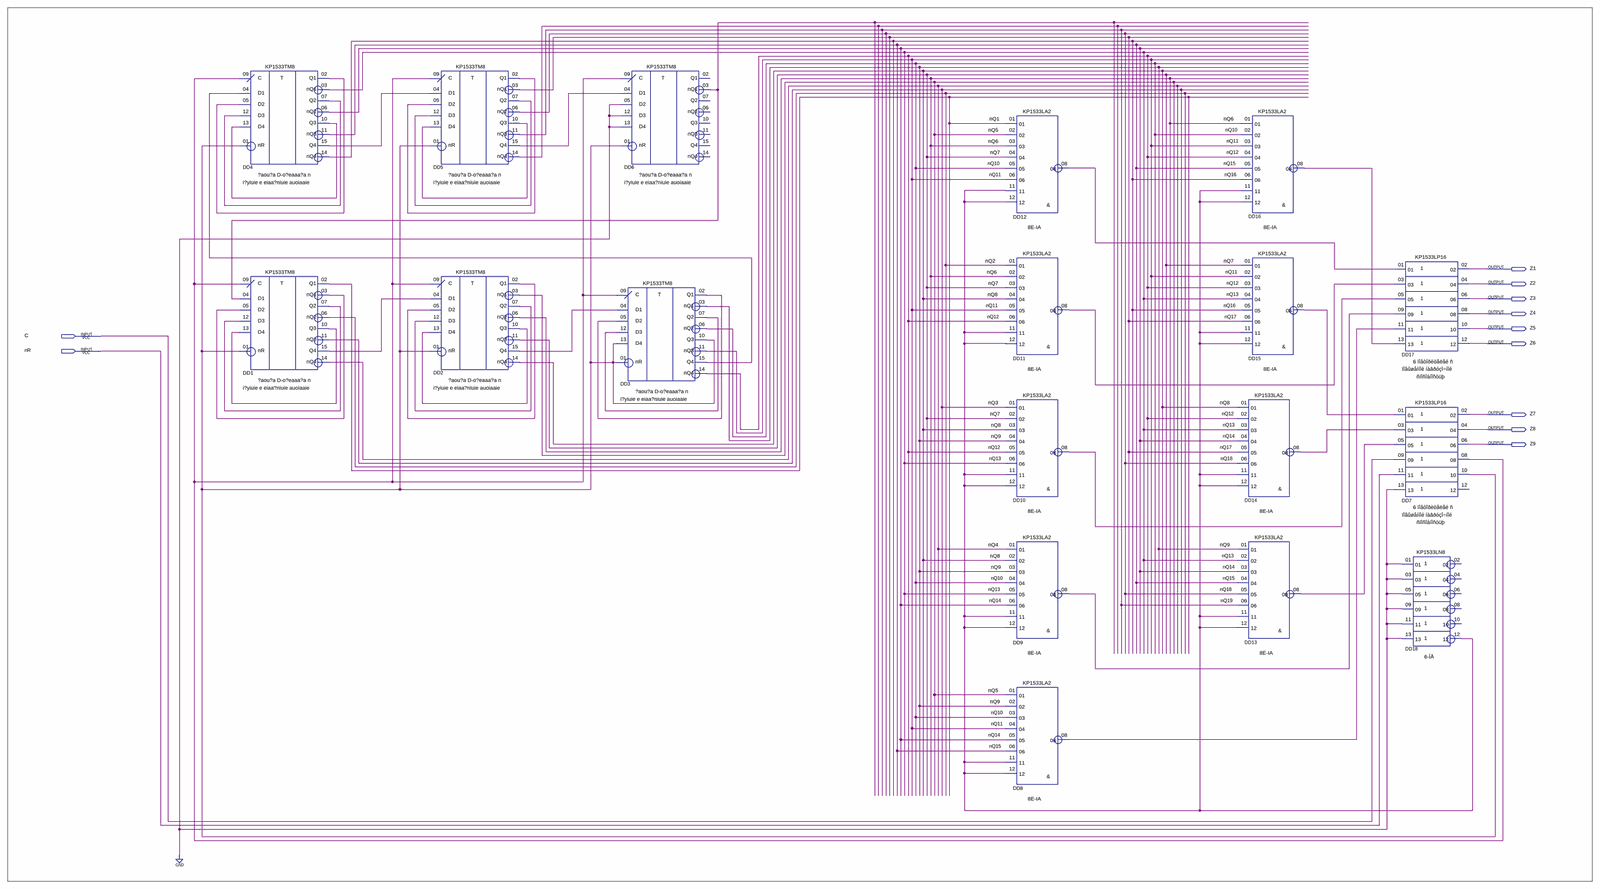
[diagram p0: schematic sheet, whole]
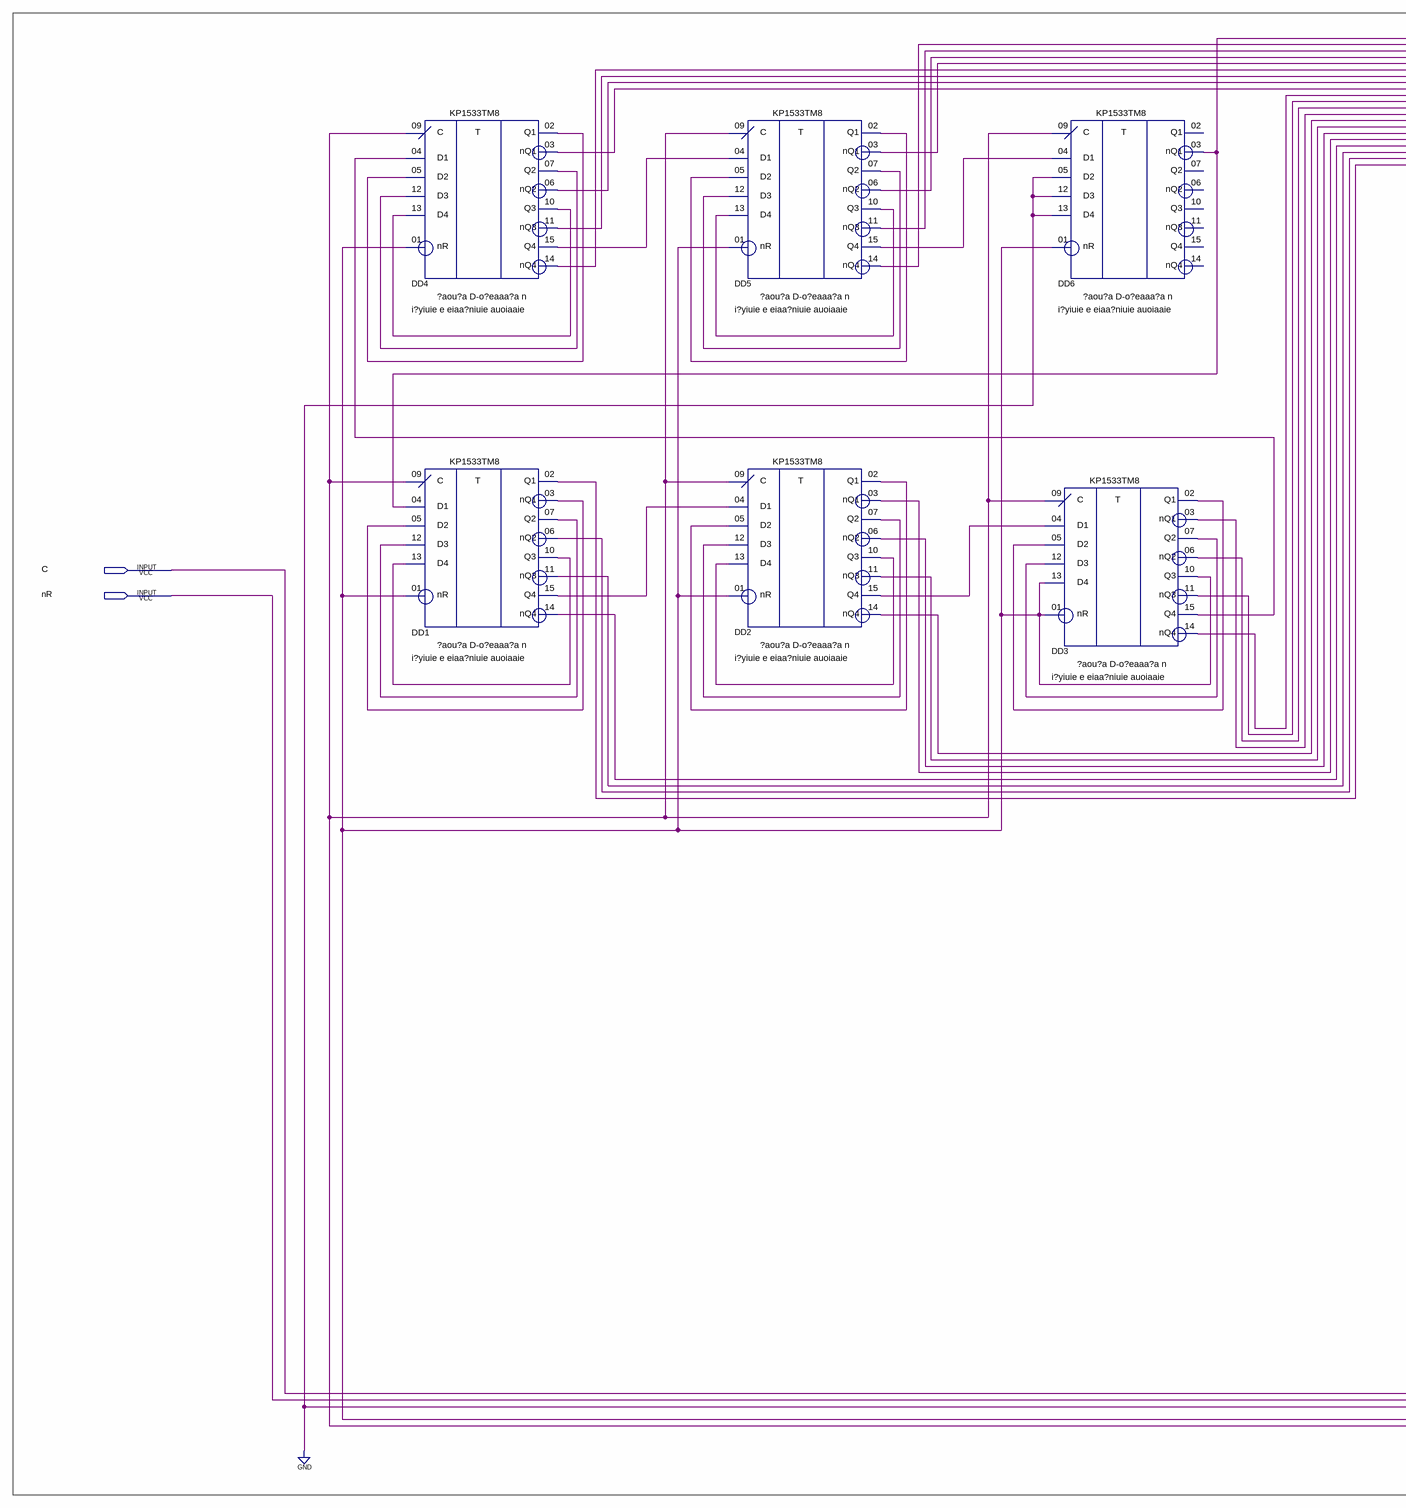
[diagram p1: schematic sheet, left part]
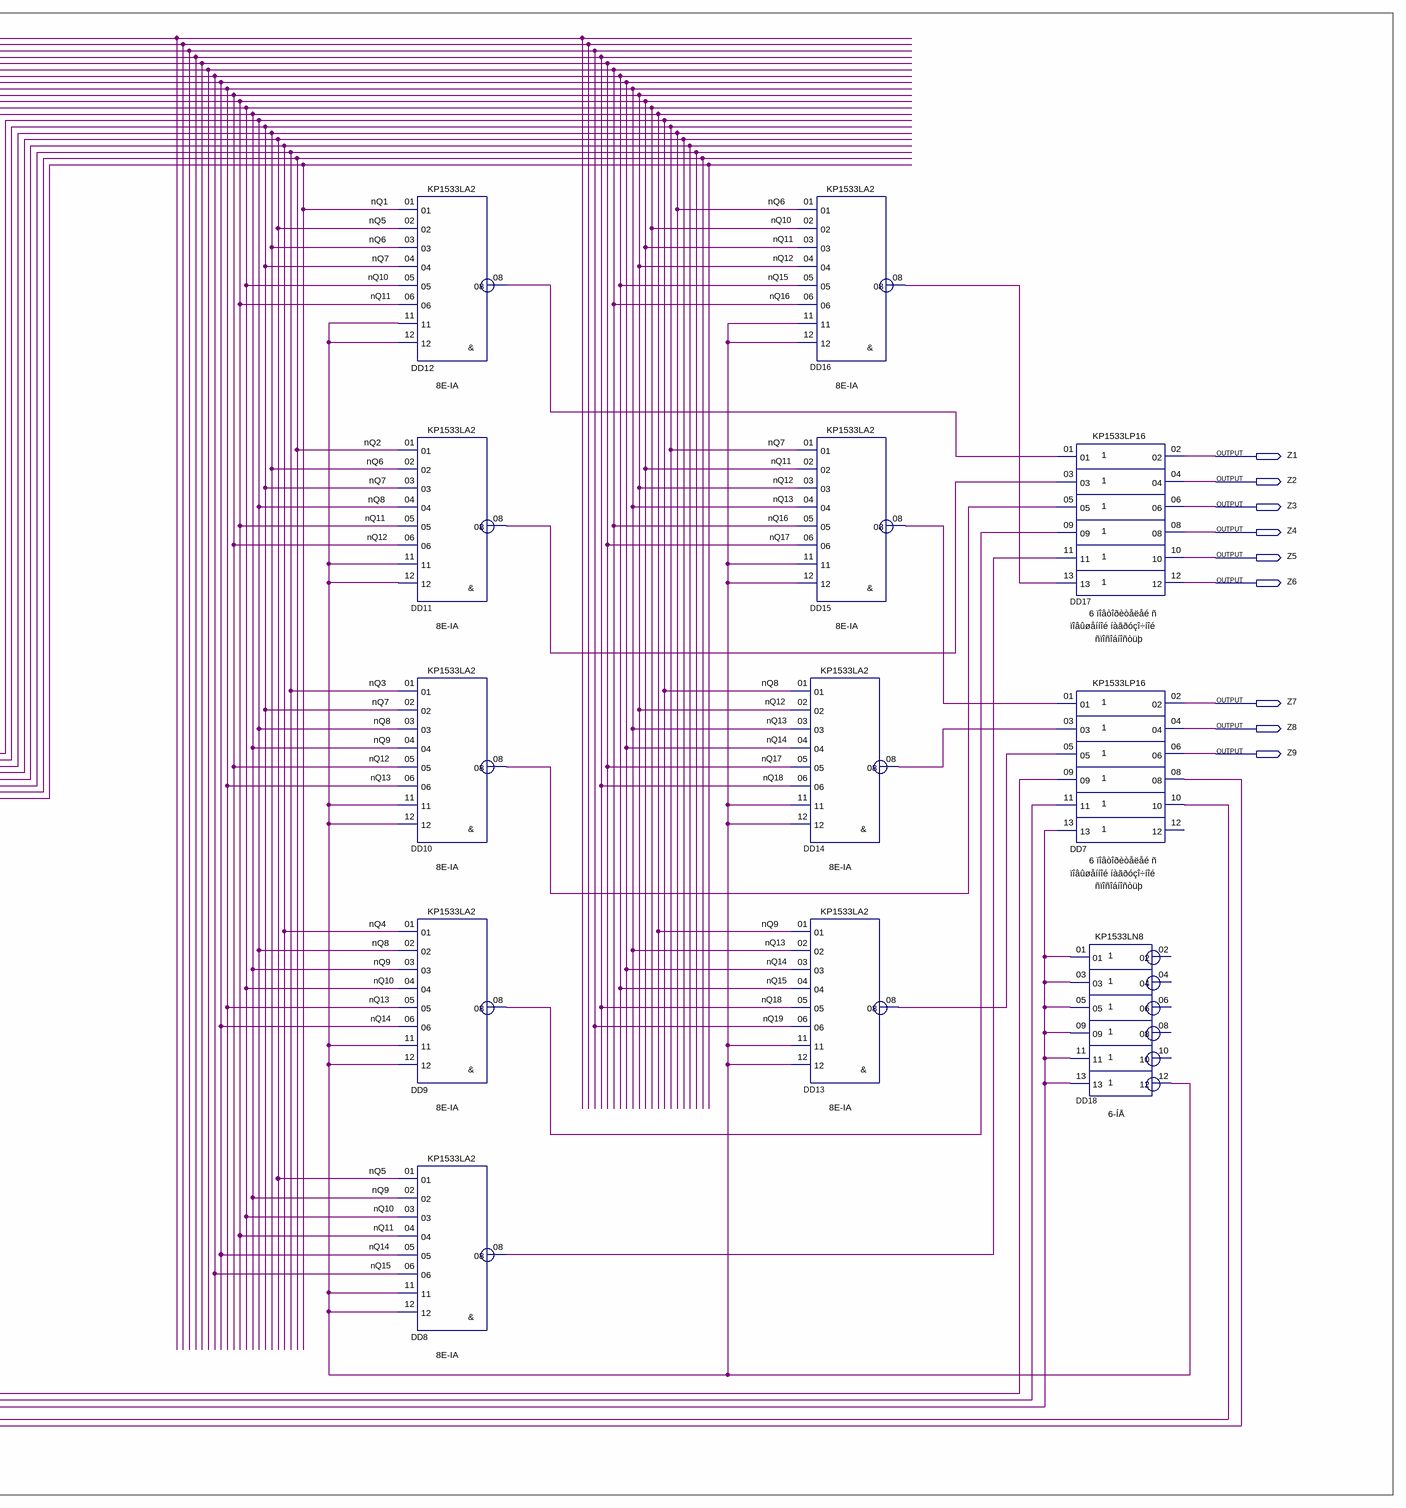
[diagram p2: schematic sheet, right part]
// Quartus schematic GN_RC_DFF_PK_NAND.bdf as structural Verilog: 18 symbols, 11 pins
module GN_RC_DFF_PK_NAND (
  input  C,
  input  nR,
  output Z1,
  output Z2,
  output Z3,
  output Z4,
  output Z5,
  output Z6,
  output Z7,
  output Z8,
  output Z9
);

  wire DD1_nq1, DD1_q2, DD1_q3, DD1_q4, DD2_q1, DD2_q2, DD2_q3, DD2_q4, DD3_q1, DD3_q2, DD3_q3, DD3_q4,
       DD4_q1, DD4_q2, DD4_q3, DD4_q4, DD5_nq4, DD5_q1, DD5_q2, DD5_q3, DD5_q4, DD6_nq1, DD7_08, DD8_08,
       DD9_08, DD10_08, DD11_08, DD12_08, DD13_08, DD14_08, DD15_08, DD16_08, DD18_12, nQ1, nQ2, nQ3, nQ4,
       nQ5, nQ6, nQ7, nQ8, nQ9, nQ10, nQ11, nQ12, nQ13, nQ14, nQ15, nQ16, nQ17, nQ18, nQ19;

  KP1533TM8 DD4 (
    .nR(DD3_q3), .C(DD7_08), .D1(DD3_q4), .D2(DD4_q1), .D3(DD4_q2), .D4(DD4_q3), .Q1(DD4_q1), .nQ1(nQ13),
    .Q2(DD4_q2), .nQ2(nQ14), .Q3(DD4_q3), .nQ3(nQ15), .Q4(DD4_q4), .nQ4(nQ16));
  KP1533TM8 DD1 (
    .nR(DD3_q3), .C(DD7_08), .D1(DD6_nq1), .D2(DD1_nq1), .D3(DD1_q2), .D4(DD1_q3), .Q1(nQ1), .nQ1(DD1_nq1),
    .Q2(DD1_q2), .nQ2(nQ2), .Q3(DD1_q3), .nQ3(nQ3), .Q4(DD1_q4), .nQ4(nQ4));
  KP1533TM8 DD5 (
    .nR(DD3_q3), .C(DD7_08), .D1(DD4_q4), .D2(DD5_q1), .D3(DD5_q2), .D4(DD5_q3), .Q1(DD5_q1), .nQ1(nQ17),
    .Q2(DD5_q2), .nQ2(nQ18), .Q3(DD5_q3), .nQ3(nQ19), .Q4(DD5_q4), .nQ4(DD5_nq4));
  KP1533TM8 DD2 (
    .nR(DD3_q3), .C(DD7_08), .D1(DD1_q4), .D2(DD2_q1), .D3(DD2_q2), .D4(DD2_q3), .Q1(DD2_q1), .nQ1(nQ5),
    .Q2(DD2_q2), .nQ2(nQ6), .Q3(DD2_q3), .nQ3(nQ7), .Q4(DD2_q4), .nQ4(nQ8));
  KP1533TM8 DD6 (
    .nR(DD3_q3), .C(DD7_08), .D1(DD5_q4), .D2(1'b0), .D3(1'b0), .D4(1'b0), .nQ1(DD6_nq1));  // open: Q1, Q2, nQ2, Q3, nQ3, Q4, nQ4
  KP1533TM8 DD3 (
    .nR(DD3_q3), .C(DD7_08), .D1(DD2_q4), .D2(DD3_q1), .D3(DD3_q2), .D4(DD3_q3), .Q1(DD3_q1), .nQ1(nQ9),
    .Q2(DD3_q2), .nQ2(nQ10), .Q3(DD3_q3), .nQ3(nQ11), .Q4(DD3_q4), .nQ4(nQ12));
  KP1533LA2 DD12 (
    .\01 (nQ1), .\02 (nQ5), .\03 (nQ6), .\04 (nQ7), .\05 (nQ10), .\06 (nQ11), .\11 (DD18_12), .\12 (DD18_12),
    .\08 (DD12_08));
  KP1533LA2 DD11 (
    .\01 (nQ2), .\02 (nQ6), .\03 (nQ7), .\04 (nQ8), .\05 (nQ11), .\06 (nQ12), .\11 (DD18_12), .\12 (DD18_12),
    .\08 (DD11_08));
  KP1533LA2 DD10 (
    .\01 (nQ3), .\02 (nQ7), .\03 (nQ8), .\04 (nQ9), .\05 (nQ12), .\06 (nQ13), .\11 (DD18_12), .\12 (DD18_12),
    .\08 (DD10_08));
  KP1533LA2 DD9 (
    .\01 (nQ4), .\02 (nQ8), .\03 (nQ9), .\04 (nQ10), .\05 (nQ13), .\06 (nQ14), .\11 (DD18_12),
    .\12 (DD18_12), .\08 (DD9_08));
  KP1533LA2 DD8 (
    .\01 (nQ5), .\02 (nQ9), .\03 (nQ10), .\04 (nQ11), .\05 (nQ14), .\06 (nQ15), .\11 (DD18_12),
    .\12 (DD18_12), .\08 (DD8_08));
  KP1533LA2 DD16 (
    .\01 (nQ6), .\02 (nQ10), .\03 (nQ11), .\04 (nQ12), .\05 (nQ15), .\06 (nQ16), .\11 (DD18_12),
    .\12 (DD18_12), .\08 (DD16_08));
  KP1533LA2 DD15 (
    .\01 (nQ7), .\02 (nQ11), .\03 (nQ12), .\04 (nQ13), .\05 (nQ16), .\06 (nQ17), .\11 (DD18_12),
    .\12 (DD18_12), .\08 (DD15_08));
  KP1533LA2 DD14 (
    .\01 (nQ8), .\02 (nQ12), .\03 (nQ13), .\04 (nQ14), .\05 (nQ17), .\06 (nQ18), .\11 (DD18_12),
    .\12 (DD18_12), .\08 (DD14_08));
  KP1533LA2 DD13 (
    .\01 (nQ9), .\02 (nQ13), .\03 (nQ14), .\04 (nQ15), .\05 (nQ18), .\06 (nQ19), .\11 (DD18_12),
    .\12 (DD18_12), .\08 (DD13_08));
  KP1533LP16 DD17 (
    .\01 (DD12_08), .\03 (DD11_08), .\05 (DD10_08), .\09 (DD9_08), .\11 (DD8_08), .\13 (DD16_08), .\02 (Z1),
    .\04 (Z2), .\06 (Z3), .\08 (Z4), .\10 (Z5), .\12 (Z6));
  KP1533LP16 DD7 (
    .\01 (DD15_08), .\03 (DD14_08), .\05 (DD13_08), .\09 (C), .\11 (nR), .\13 (1'b0), .\02 (Z7), .\04 (Z8),
    .\06 (Z9), .\08 (DD7_08), .\10 (DD3_q3));  // open: 12
  KP1533LN8 DD18 (
    .\01 (1'b0), .\03 (1'b0), .\05 (1'b0), .\09 (1'b0), .\11 (1'b0), .\13 (1'b0), .\12 (DD18_12));  // open: 02, 04, 06, 08, 10
endmodule
